# EAGLE design Thermocouple Digitizer (EAGLE 6.0)
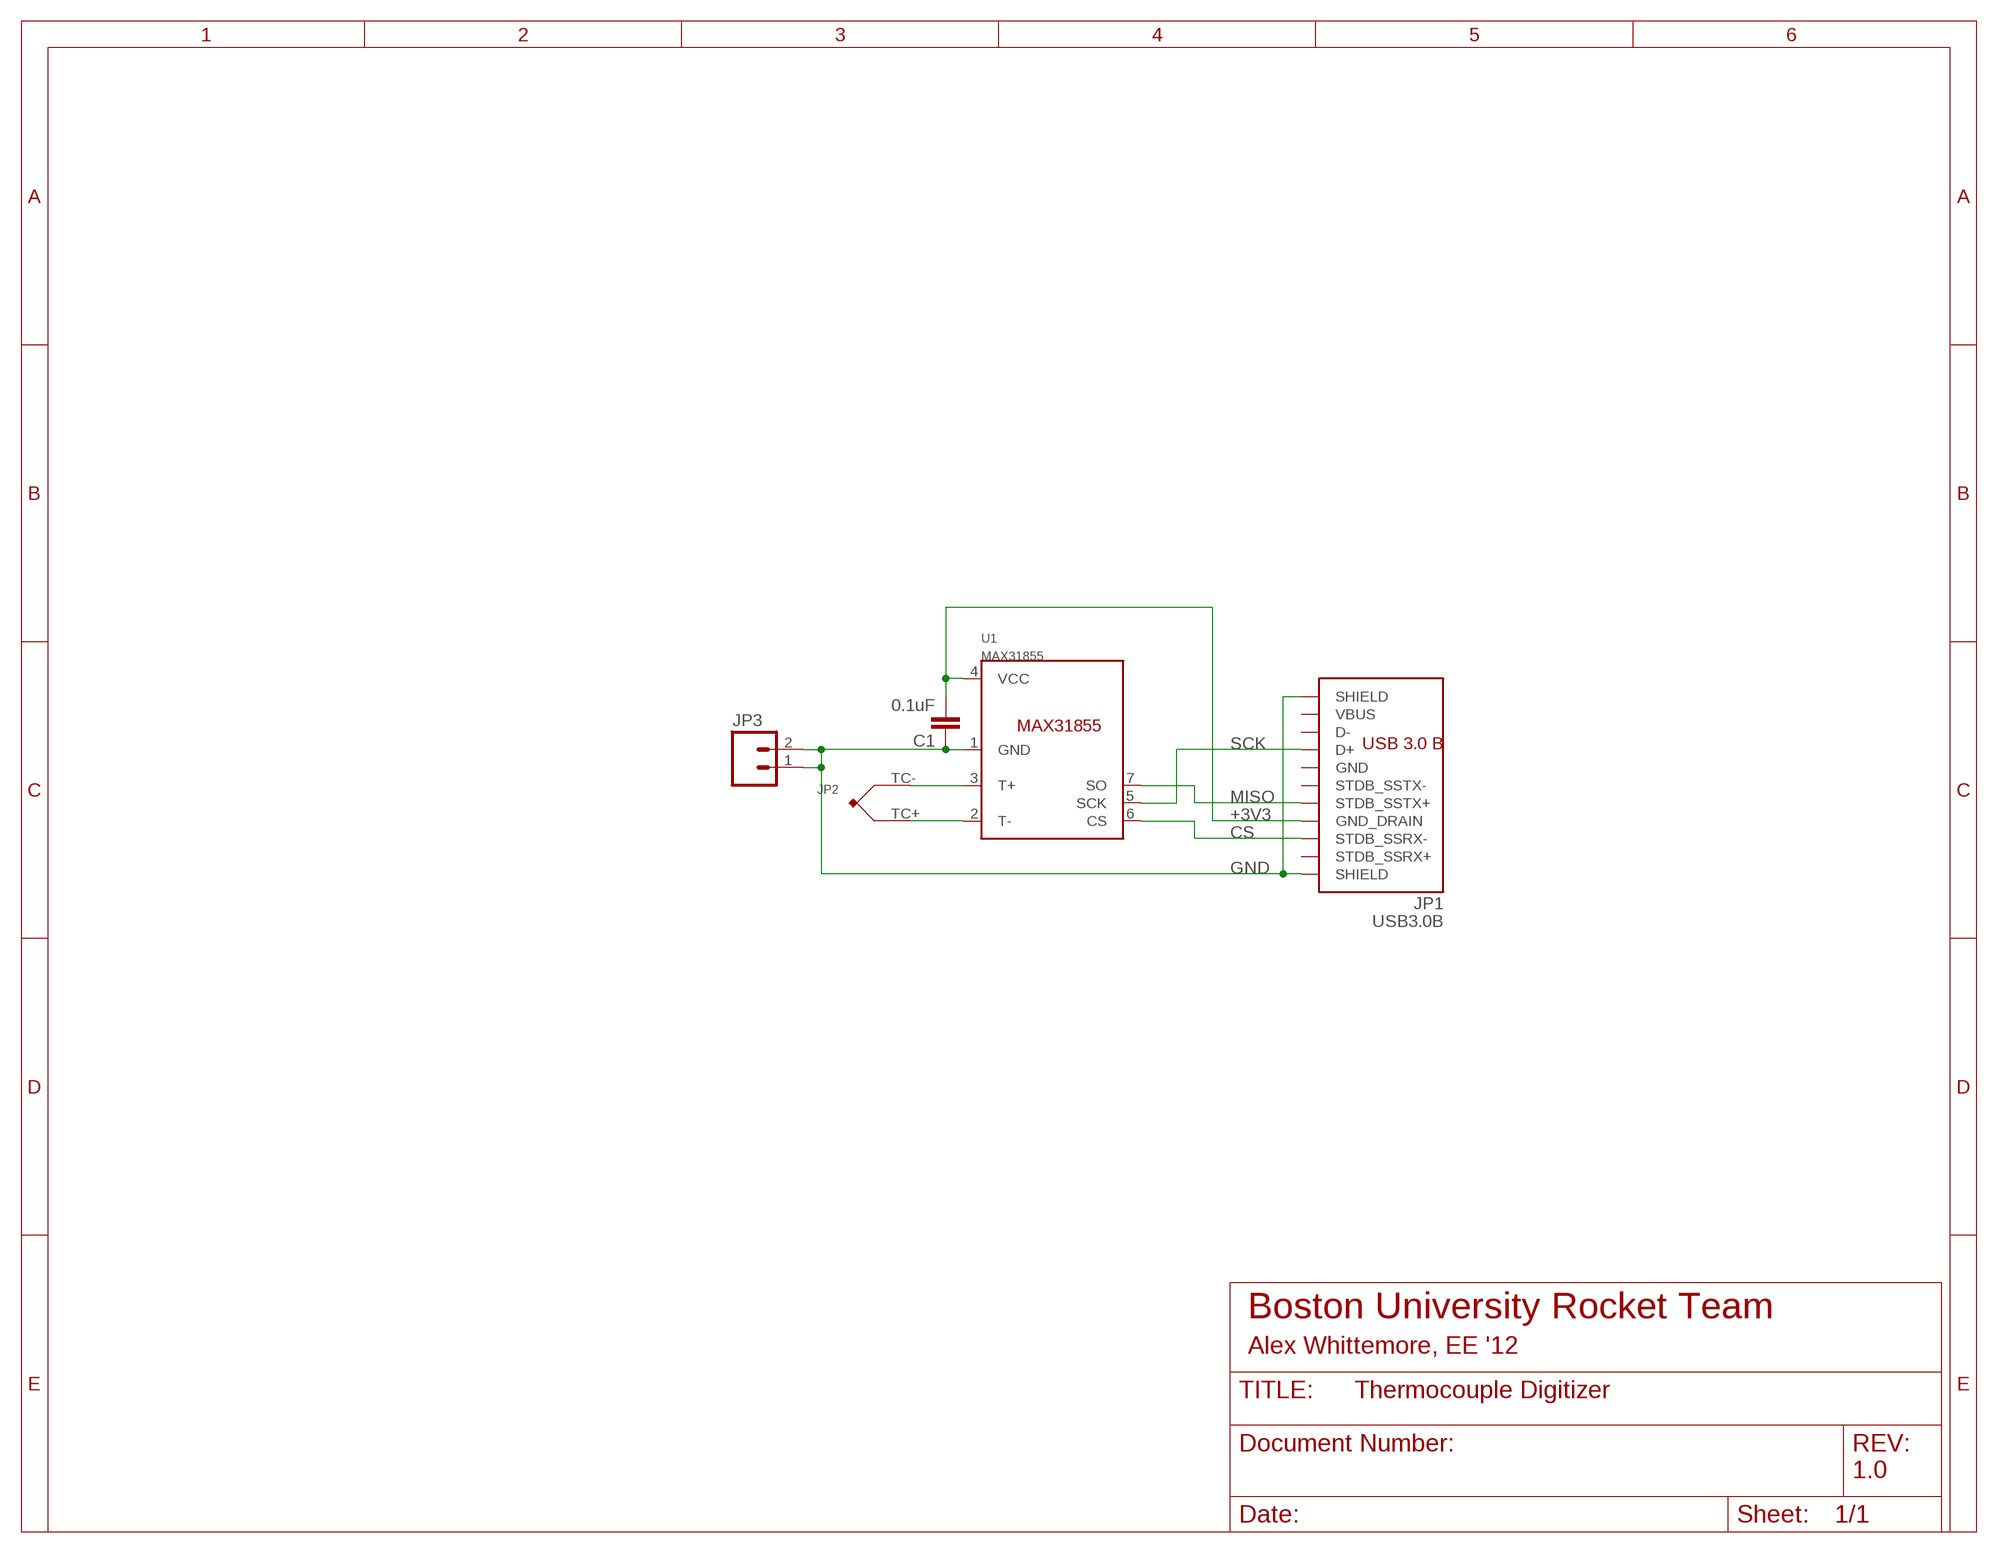
[diagram p0: schematic, sheet 1]

## Parts
C1  0.1uF  CAP0402-CAP  [0402-CAP]
JP1  USB3.0B  [AMPHENOLUSB3.0B]
JP2  OMEGA_PCC-SMP  [OMEGA_PCC-SMP]
JP3  M025MM  [SCREWTERMINAL-5MM-2]
U1  MAX31855  [SOIC8]

## Nets
+3V3: C1.2 JP1.7(GND_DRAIN) U1.4(VCC)
CS: JP1.8(STDB_SSRX-) U1.6(CS)
GND: C1.1 JP1.10@1(SHIELD) JP1.10@2(SHIELD) JP3.1 JP3.2 U1.1(GND)
MISO: JP1.6(STDB_SSTX+) U1.7(SO)
N$1: JP2.TC- U1.3(T+)
N$2: JP2.TC+ U1.2(T-)
SCK: JP1.3(D+) U1.5(SCK)
Unconnected: JP1.1(VBUS) JP1.2(D-) JP1.4(GND) JP1.5(STDB_SSTX-) JP1.9(STDB_SSRX+)

## Notes on the sheet
- Boston University Rocket Team
- Alex Whittemore, EE '12
- 1.0

## Library data of the parts
C1 = SparkFun:CAP: Capacitor Standard 0603 ceramic capacitor, and 0.1" leaded capacitor.
JP1 = AlexsParts:USB3.0B: USB3.0B Amphenol USB 3.0 B connector
JP2 = AlexsParts:OMEGA_PCC-SMP: Omega SMP-type board mount thermocouple connector
JP3 = SparkFun:M02: Header 2 Standard 2-pin 0.1" header. Use with straight break away headers (SKU : PRT-00116), right angle break away headers (PRT-00553), swiss pins (PRT-00743), machine pins (PRT-00117), and female headers (PRT-00115). Molex polarized connector foot print use with SKU : PRT-08233 with associated crimp pins and housings.
U1 = AlexsParts:MAX31855

## Board
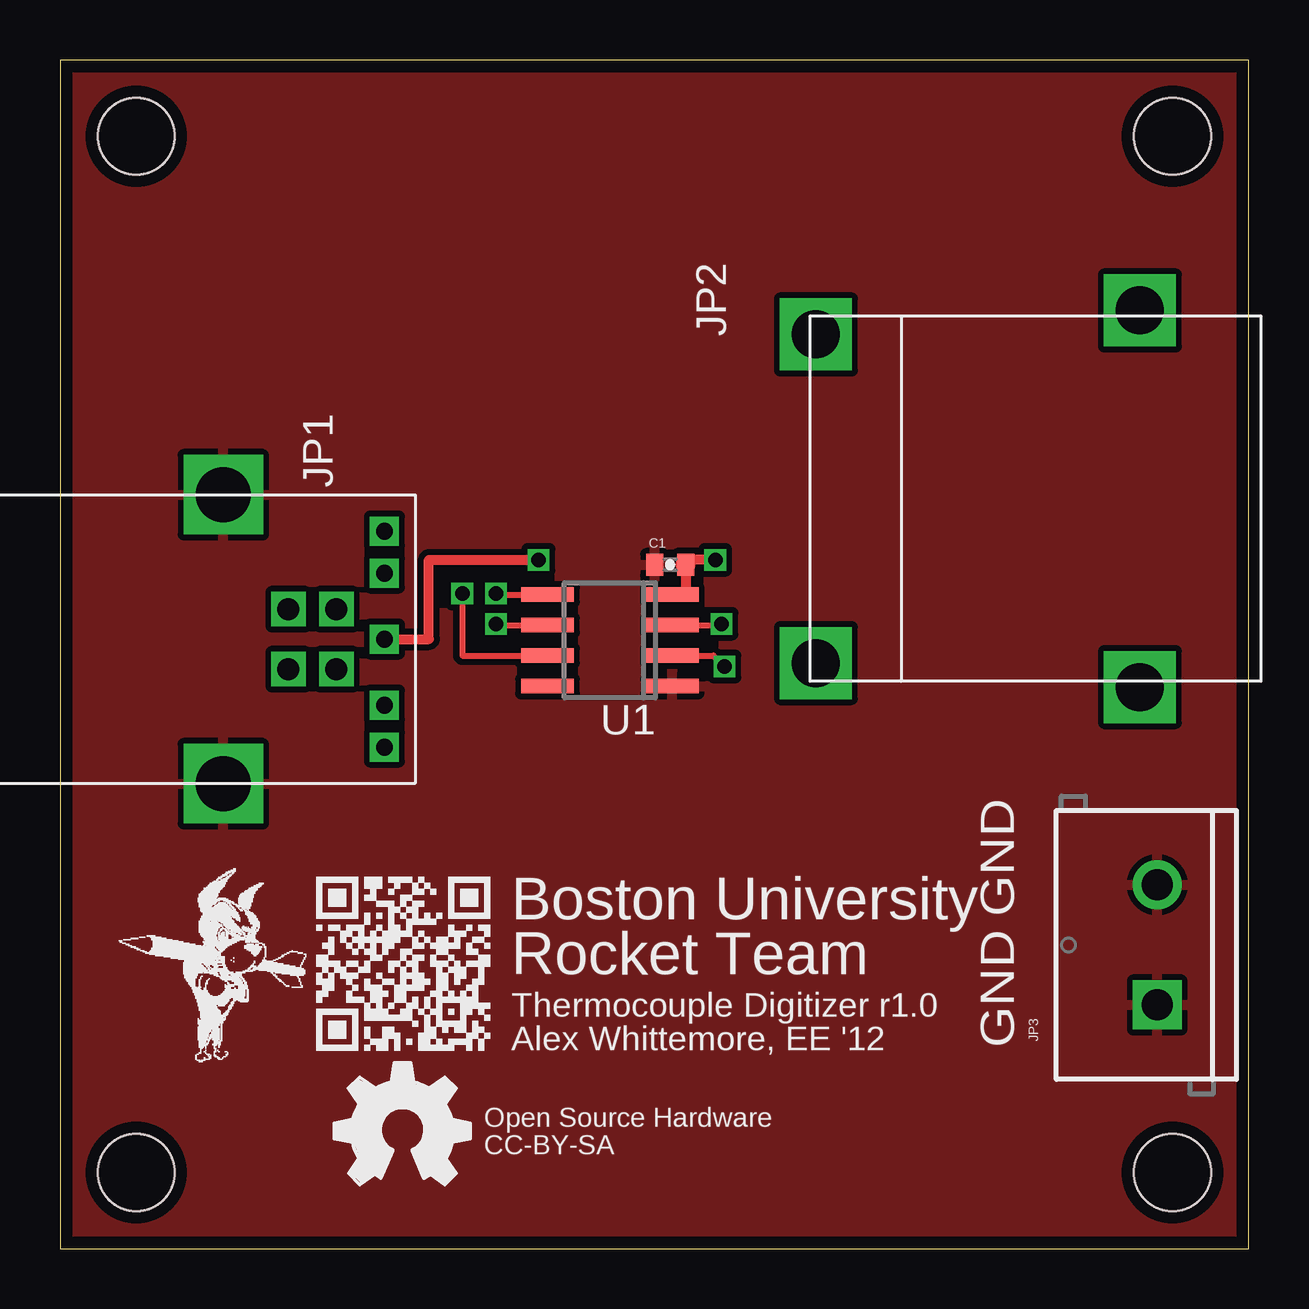
[diagram p1: board, top side]
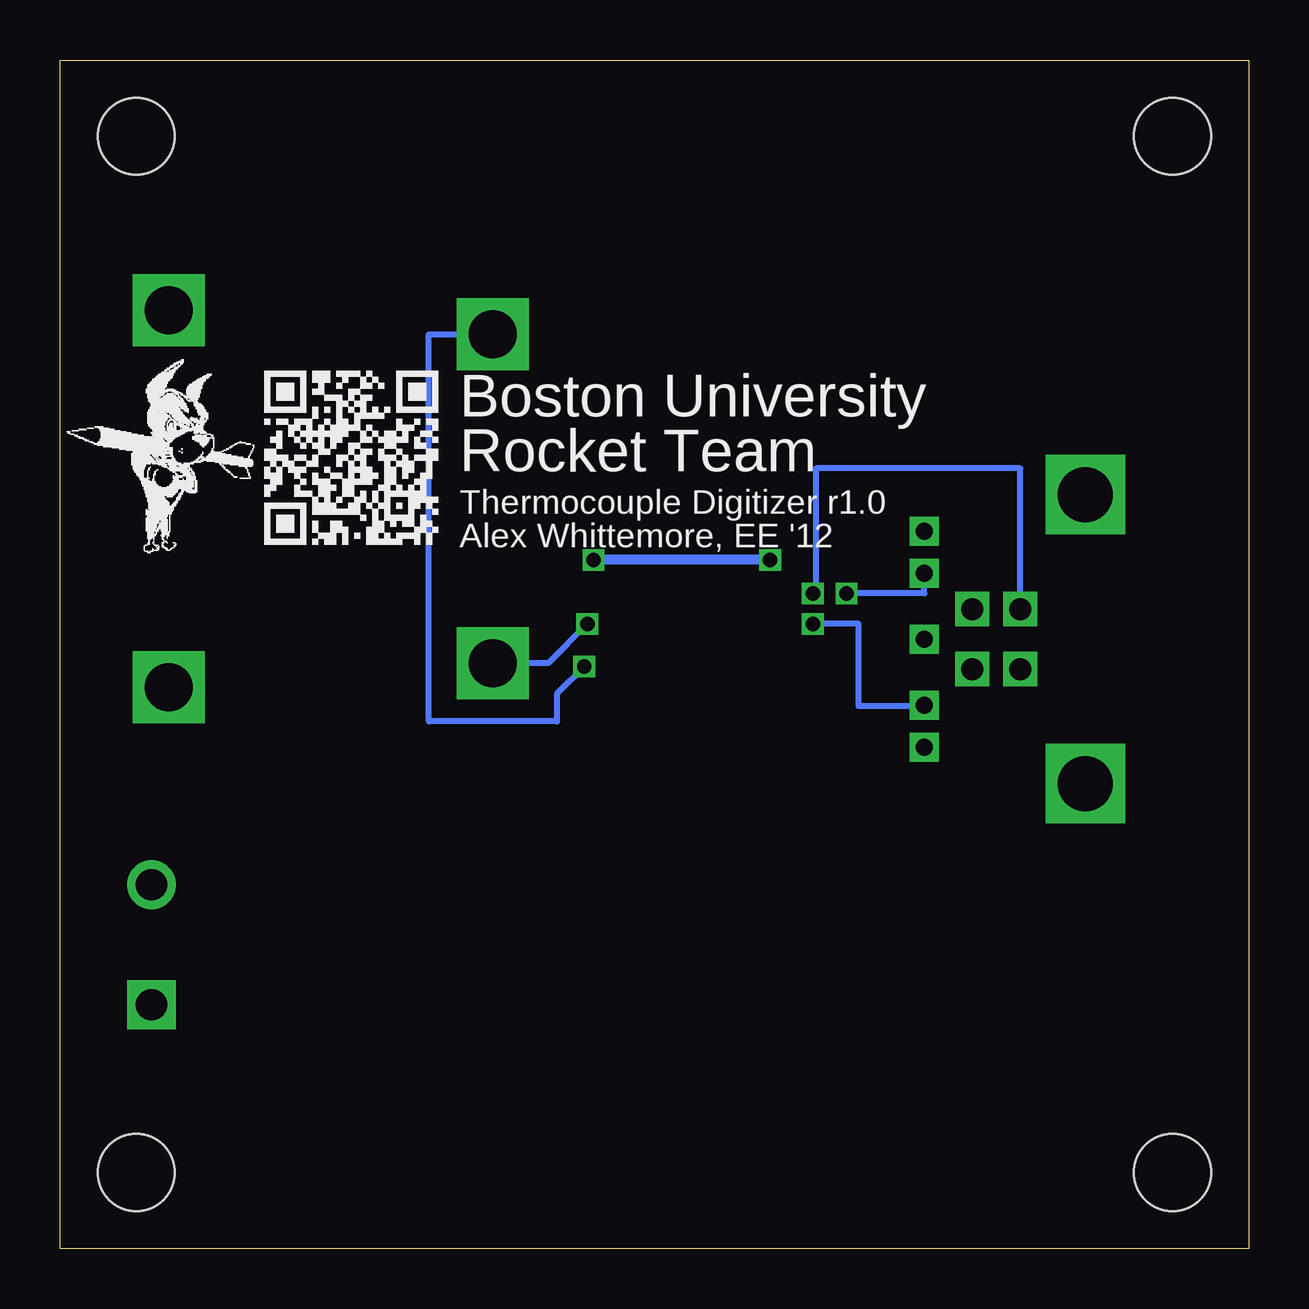
[diagram p2: board, bottom side, seen from below]

Size 49.53 x 49.53 mm. Coordinates in mm from the lower left corner, seen from the top.
Outline: 0,0 49.53,0 49.53,49.53 0,49.53 0,0
Copper layers (1*16): Top 0.035mm / dielectric 1.5mm / Bottom 0.035mm
Design rules: minimum track width 6mil, minimum drill 12mil, track to track 8mil, track to pad 8mil, pad to pad 8mil, via to via 8mil, smd to smd 0mil, copper to edge 20mil, drill to drill 10mil, minimum pad ring 10mil, minimum via ring 6mil, stop-mask expansion 2mil, vias tented up to drill 100mil, thermal gap 10mil
Holes 3.2 mm at 3.17,46.35 3.17,3.17 46.35,3.17 46.35,46.35

### Footprints (pad centres in the part's own frame; a part is rotated, then mirrored left to right if it is on the bottom)
0402-CAP = smd 0.7 x 0.9: 1 -0.65,0; 2 0.65,0
AMPHENOLUSB3.0B = drill 0.92 square: 1 1.25,4.71; 2 -1.25,4.71; 3 -1.25,2.71; 4 1.25,2.71 | drill 0.7 square: 5 -4.5,6.71; 6 -2.75,6.71; 7 0,6.71; 8 2.75,6.71; 9 4.5,6.71 | drill 2.3 square: 10@1 -6.02,0; 10@2 6.02,0
OMEGA_PCC-SMP = drill 2 square: CLIP#1 -1,13.5; CLIP#2 14.7,13.5; TC+ 0,0; TC- 13.7,0
SCREWTERMINAL-5MM-2 = drill 1.3 pad 2.032 square: 1 0,0 | drill 1.3 pad 2.032: 2 5,0
SOIC8 = smd 0.6 x 2.2: 1 -1.905,-2.6; 2 -0.635,-2.6; 3 0.635,-2.6; 4 1.905,-2.6; 5 1.905,2.6; 6 0.635,2.6; 7 -0.635,2.6; 8 -1.905,2.6

### Placement (x,y rotation side)
C1  25.43,28.5 0 top
JP1  6.81,25.4 270 top
JP2  31.5,38.1 270 top
JP3  45.72,10.16 90 top
U1  22.91,25.35 90 top
U$1  [OSHW_FILLX200_NOTEXT]  11.43,2.67 0 top

### Tracks (layer width: path | path; a pad name or v marks a point on that pad's centre or on a via)
+3V3  (via drill 0.6)
  Top 0.406: U1.4 26.07,27.25 C1.2 26.07,28.7 v27.3,28.7 | JP1.7 15.37,25.4 15.37,28.7 v19.94,28.7
  Top 0.813: C1.2 26.06,28.5
  Bottom 0.406: v19.94,28.7 v27.3,28.7
CS  (via drill 0.6)
  Top 0.254: U1.6 18.16,25.98 v18.16,26.04
  Bottom 0.254: v18.16,26.04 16.26,26.04 16.26,22.61 13.52,22.61 JP1.8
GND
  pour Top (isolate 0.254): 0,49.53 49.53,49.53 49.53,0 0,0
MISO  (via drill 0.6)
  Top 0.254: U1.7 16.76,24.71 v16.76,27.3
  Bottom 0.254: v16.76,27.3 13.52,27.3 JP1.6
N$1  (via drill 0.6)
  Top 0.254: U1.3 27.56,25.98 v27.56,26.04
  Bottom 0.254: v27.56,26.04 29.19,24.4 JP2.TC-
N$2  (via drill 0.6)
  Top 0.254: U1.2 27.23,24.71 v27.69,24.26
  Bottom 0.254: v27.69,24.26 28.83,23.11 28.83,21.97 34.16,21.97 34.16,38.1 JP2.TC+
SCK  (via drill 0.6)
  Top 0.254: U1.5 18.16,27.25 v18.16,27.3
  Bottom 0.254: v18.16,27.3 18.03,27.3 18.03,32.51 9.52,32.51 JP1.3

### Text on the board
_tsilk: Boston University | GND | Rocket Team | Thermocouple Digitizer r1.0 | Alex Whittemore, EE '12 | GND | Open Source Hardware | CC-BY-SA
_bsilk: Boston University | Rocket Team | Thermocouple Digitizer r1.0 | Alex Whittemore, EE '12